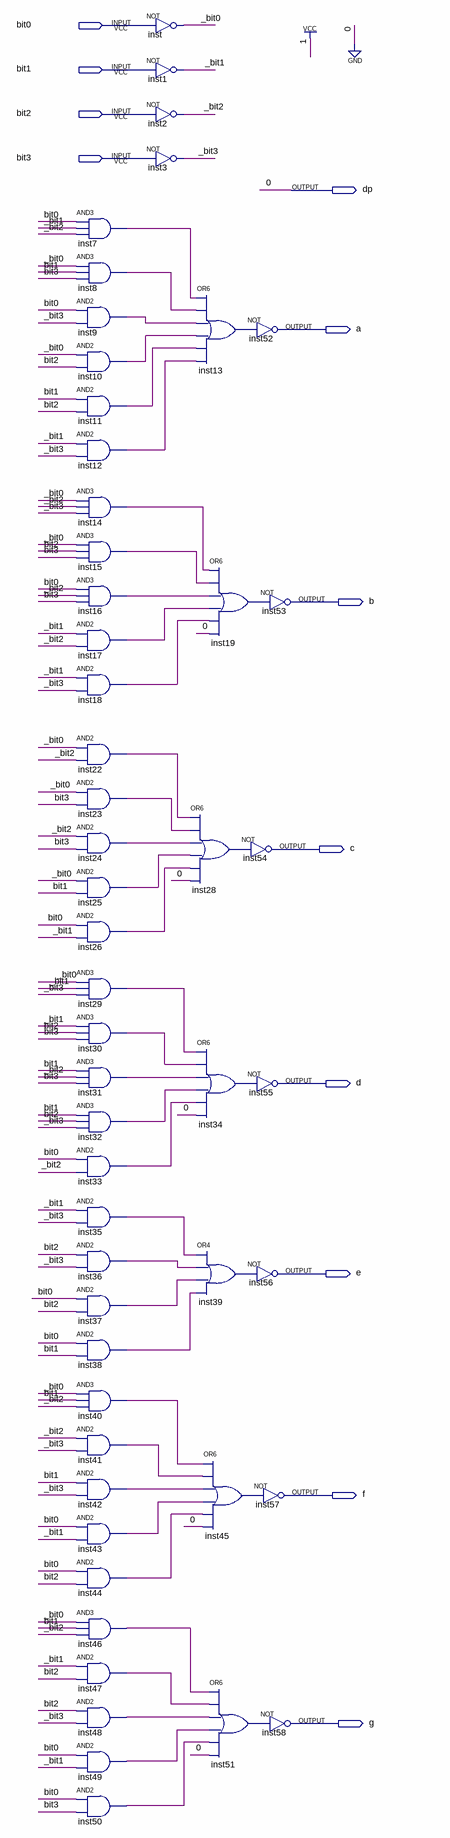
[diagram p0: schematic sheet]
// Quartus schematic SevenSegmentInterface1.bdf as structural Verilog: 53 symbols, 12 pins
module SevenSegmentInterface1 (
  input  bit0,
  input  bit1,
  input  bit2,
  input  bit3,
  output dp,
  output a,
  output b,
  output c,
  output d,
  output e,
  output f,
  output g
);

  wire _bit0, _bit1, _bit2, _bit3, inst7_out, inst8_out, inst9_out, inst10_out, inst11_out, inst12_out,
       inst13_out, inst14_out, inst15_out, inst16_out, inst17_out, inst18_out, inst19_out, inst22_out,
       inst23_out, inst24_out, inst25_out, inst26_out, inst28_out, inst29_out, inst30_out, inst31_out,
       inst32_out, inst33_out, inst34_out, inst35_out, inst36_out, inst37_out, inst38_out, inst39_out,
       inst40_out, inst41_out, inst42_out, inst43_out, inst44_out, inst45_out, inst46_out, inst47_out,
       inst48_out, inst49_out, inst50_out, inst51_out;

  and inst7 (inst7_out, bit0, _bit1, _bit2);
  and inst8 (inst8_out, _bit0, bit1, bit3);
  and inst9 (inst9_out, bit0, _bit3);
  and inst10 (inst10_out, _bit0, bit2);
  and inst11 (inst11_out, bit1, bit2);
  and inst12 (inst12_out, _bit1, _bit3);
  and inst14 (inst14_out, _bit0, _bit2, _bit3);
  and inst15 (inst15_out, _bit0, bit2, bit3);
  and inst16 (inst16_out, bit0, _bit2, bit3);
  and inst17 (inst17_out, _bit1, _bit2);
  and inst18 (inst18_out, _bit1, _bit3);
  and inst22 (inst22_out, _bit0, _bit2);
  and inst23 (inst23_out, _bit0, bit3);
  and inst24 (inst24_out, _bit2, bit3);
  and inst25 (inst25_out, _bit0, bit1);
  and inst26 (inst26_out, bit0, _bit1);
  and inst29 (inst29_out, _bit0, _bit1, _bit3);
  and inst30 (inst30_out, _bit1, bit2, bit3);
  and inst31 (inst31_out, bit1, _bit2, bit3);
  and inst32 (inst32_out, bit1, bit2, _bit3);
  and inst33 (inst33_out, bit0, _bit2);
  and inst35 (inst35_out, _bit1, _bit3);
  and inst36 (inst36_out, bit2, _bit3);
  and inst37 (inst37_out, bit0, bit2);
  and inst38 (inst38_out, bit0, bit1);
  and inst40 (inst40_out, _bit0, bit1, _bit2);
  and inst41 (inst41_out, _bit2, _bit3);
  and inst42 (inst42_out, bit1, _bit3);
  and inst43 (inst43_out, bit0, _bit1);
  and inst44 (inst44_out, bit0, bit2);
  and inst46 (inst46_out, _bit0, bit1, _bit2);
  and inst47 (inst47_out, _bit1, bit2);
  and inst48 (inst48_out, bit2, _bit3);
  and inst49 (inst49_out, bit0, _bit1);
  and inst50 (inst50_out, bit0, bit3);
  not inst (_bit0, bit0);
  not inst1 (_bit1, bit1);
  not inst2 (_bit2, bit2);
  not inst3 (_bit3, bit3);
  or inst13 (inst13_out, inst7_out, inst8_out, inst9_out, inst10_out, inst11_out, inst12_out);
  or inst19 (inst19_out, inst14_out, inst15_out, inst16_out, inst17_out, inst18_out, 1'b0);
  or inst28 (inst28_out, inst22_out, inst23_out, inst24_out, inst25_out, inst26_out, 1'b0);
  or inst34 (inst34_out, inst29_out, inst30_out, inst31_out, inst32_out, inst33_out, 1'b0);
  or inst39 (inst39_out, inst35_out, inst36_out, inst37_out, inst38_out);
  or inst45 (inst45_out, inst40_out, inst41_out, inst42_out, inst43_out, inst44_out, 1'b0);
  or inst51 (inst51_out, inst46_out, inst47_out, inst48_out, inst49_out, inst50_out, 1'b0);
  not inst52 (a, inst13_out);
  not inst53 (b, inst19_out);
  not inst54 (c, inst28_out);
  not inst55 (d, inst34_out);
  not inst56 (e, inst39_out);
  not inst57 (f, inst45_out);
  not inst58 (g, inst51_out);

  assign dp = 1'b0;
endmodule
